# EAGLE design MaxRam (EAGLE 6.5.0)
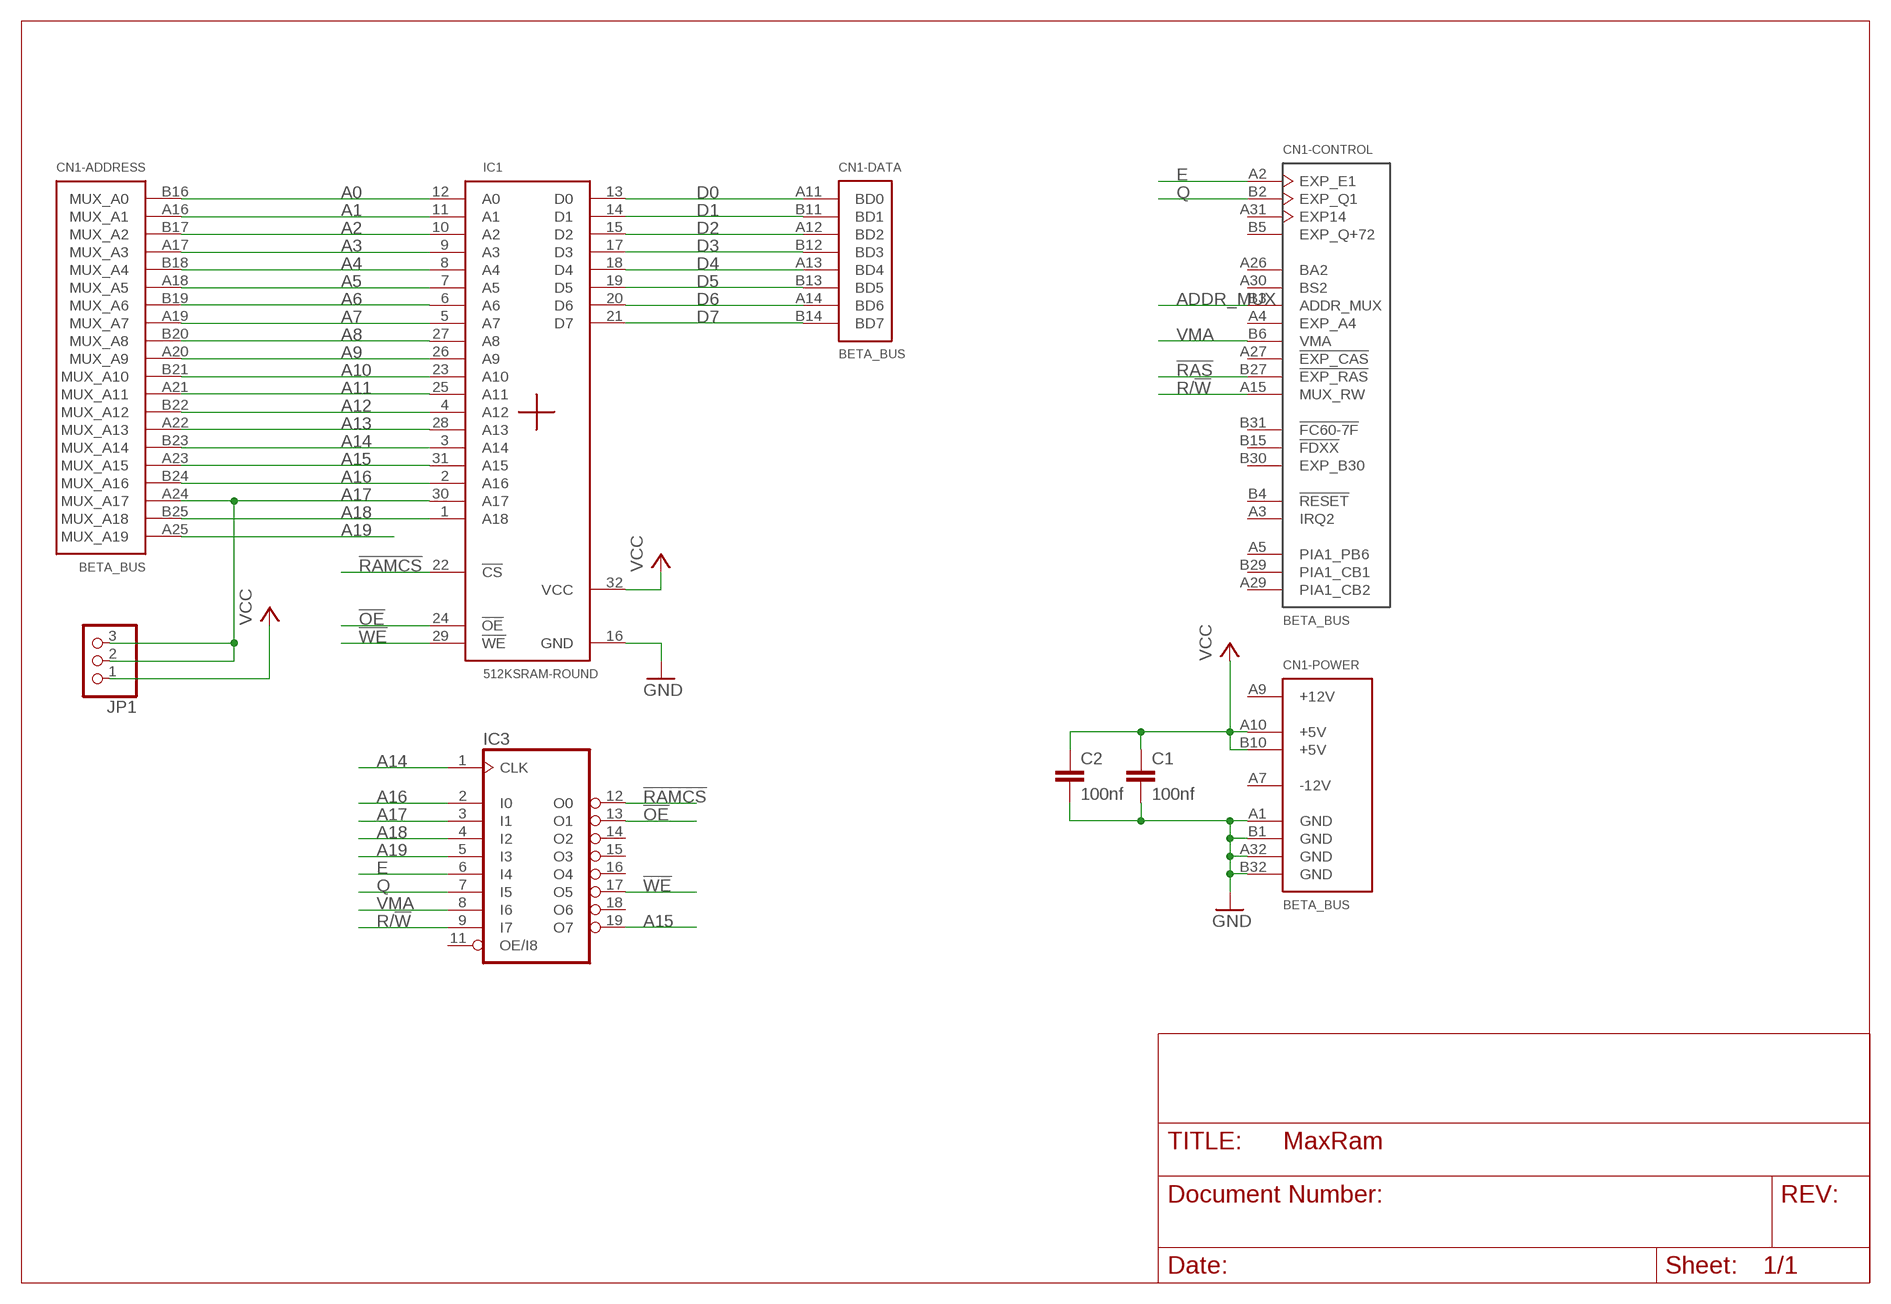
[diagram p0: schematic, sheet 1]

## Parts
C1  100nf  C-EU025-025X050  [C025-025X050]
C2  100nf  C-EU025-025X050  [C025-025X050]
CN1  BETA_BUS  [MAB64]
IC1  512KSRAM-ROUND  [DIL32-ROUND]
IC3  16V8-ROUND  [DIL20-R]
JP1  PINHD-1X3  [1X03]

## Nets
!OE: IC1.24(!OE) IC3.13(O1)
!RAMCS: IC1.22(!CS) IC3.12(O0)
!RAS: CN1.B27(-CONTROL:!EXP_RAS)
!WE: IC1.29(!WE) IC3.17(O5)
A0: CN1.B16(-ADDRESS:MUX_A0) IC1.12(A0)
A1: CN1.A16(-ADDRESS:MUX_A1) IC1.11(A1)
A2: CN1.B17(-ADDRESS:MUX_A2) IC1.10(A2)
A3: CN1.A17(-ADDRESS:MUX_A3) IC1.9(A3)
A4: CN1.B18(-ADDRESS:MUX_A4) IC1.8(A4)
A5: CN1.A18(-ADDRESS:MUX_A5) IC1.7(A5)
A6: CN1.B19(-ADDRESS:MUX_A6) IC1.6(A6)
A7: CN1.A19(-ADDRESS:MUX_A7) IC1.5(A7)
A8: CN1.B20(-ADDRESS:MUX_A8) IC1.27(A8)
A9: CN1.A20(-ADDRESS:MUX_A9) IC1.26(A9)
A10: CN1.B21(-ADDRESS:MUX_A10) IC1.23(A10)
A11: CN1.A21(-ADDRESS:MUX_A11) IC1.25(A11)
A12: CN1.B22(-ADDRESS:MUX_A12) IC1.4(A12)
A13: CN1.A22(-ADDRESS:MUX_A13) IC1.28(A13)
A14: CN1.B23(-ADDRESS:MUX_A14) IC1.3(A14) IC3.1(CLK)
A15: CN1.A23(-ADDRESS:MUX_A15) IC1.31(A15) IC3.19(O7)
A16: CN1.B24(-ADDRESS:MUX_A16) IC1.2(A16) IC3.2(I0)
A17: CN1.A24(-ADDRESS:MUX_A17) IC1.30(A17) IC3.3(I1) JP1.2 JP1.3
A18: CN1.B25(-ADDRESS:MUX_A18) IC1.1(A18) IC3.4(I2)
A19: CN1.A25(-ADDRESS:MUX_A19) IC3.5(I3)
ADDR_MUX: CN1.B3(-CONTROL:ADDR_MUX)
D0: CN1.A11(-DATA:BD0) IC1.13(D0)
D1: CN1.B11(-DATA:BD1) IC1.14(D1)
D2: CN1.A12(-DATA:BD2) IC1.15(D2)
D3: CN1.B12(-DATA:BD3) IC1.17(D3)
D4: CN1.A13(-DATA:BD4) IC1.18(D4)
D5: CN1.B13(-DATA:BD5) IC1.19(D5)
D6: CN1.A14(-DATA:BD6) IC1.20(D6)
D7: CN1.B14(-DATA:BD7) IC1.21(D7)
E: CN1.A2(-CONTROL:EXP_E1) IC3.6(I4)
GND: C1.2 C2.2 CN1.A1(-POWER:GND) CN1.A32(-POWER:GND) CN1.B1(-POWER:GND) CN1.B32(-POWER:GND) IC1.16(GND)
Q: CN1.B2(-CONTROL:EXP_Q1) IC3.7(I5)
R/!W: CN1.A15(-CONTROL:MUX_RW) IC3.9(I7)
VCC: C1.1 C2.1 CN1.A10(-POWER:+5V) CN1.B10(-POWER:+5V) IC1.32(VCC) JP1.1
VMA: CN1.B6(-CONTROL:VMA) IC3.8(I6)
Unconnected: CN1.A3(-CONTROL:IRQ2) CN1.A4(-CONTROL:EXP_A4) CN1.A5(-CONTROL:PIA1_PB6) CN1.A6(-SPARE:A6) CN1.A8(-SPARE:A8) CN1.A26(-CONTROL:BA2) CN1.A27(-CONTROL:!EXP_CAS) CN1.A28(-SPARE:A28) CN1.A29(-CONTROL:PIA1_CB2) CN1.A30(-CONTROL:BS2) CN1.A31(-CONTROL:EXP14) CN1.B4(-CONTROL:!RESET) CN1.B5(-CONTROL:EXP_Q+72) CN1.B7(-SPARE:B7) CN1.B8(-SPARE:B8) CN1.B9(-SPARE:B9) CN1.B15(-CONTROL:!FDXX) CN1.B26(-SPARE:B26) CN1.B28(-SPARE:B28) CN1.B29(-CONTROL:PIA1_CB1) CN1.B30(-CONTROL:EXP_B30) CN1.B31(-CONTROL:!FC60-7F) IC3.11(OE/I8) IC3.14(O2) IC3.15(O3) IC3.16(O4) IC3.18(O6)

## Power pins joined to a net without a drawn wire
+12V: CN1.A9(-POWER:+12V)
-12V: CN1.A7(-POWER:-12V)
GND: IC3.10(GND)
VCC: IC3.20(VCC)

## Library data of the parts
C1 C2 = rcl:C-EU: CAPACITOR, European symbol
CN1 = Conn-Dragon:BETA_BUS
IC1 = Rom-Ram:512KSRAM: 512K x 8 SRAM
IC3 = pal-phs:16V8: PAL
JP1 = pinhead-round:PINHD-1X3: PIN HEADER

## Board
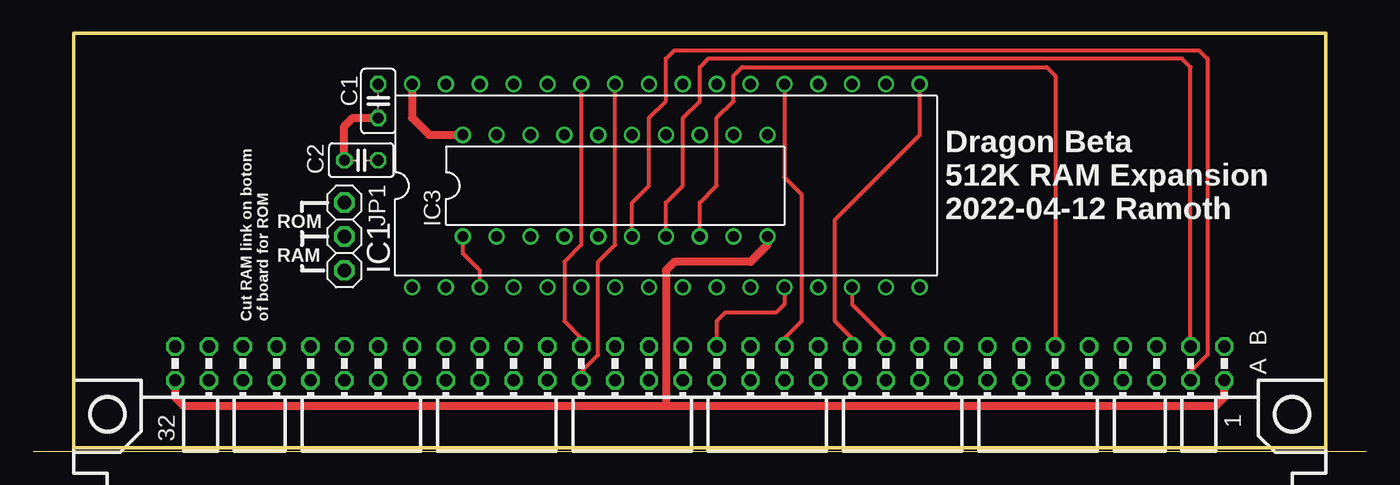
[diagram p1: board, top side]
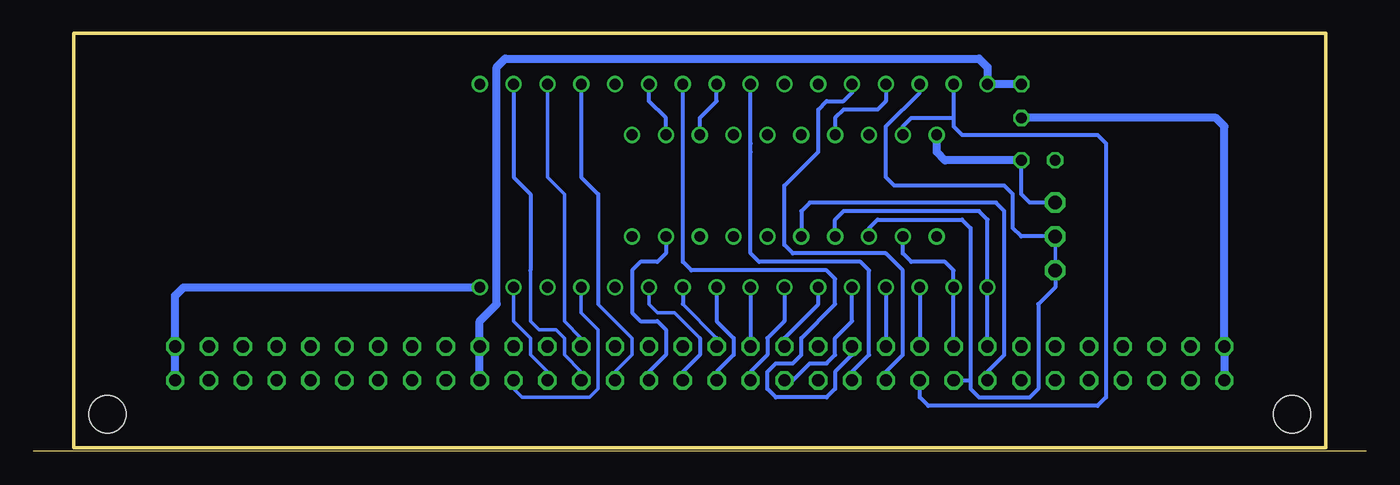
[diagram p2: board, bottom side, seen from below]

Size 93.97 x 31.09 mm. Coordinates in mm from the lower left corner, seen from the top.
Outline: 0,31.09 0,0 93.97,0 93.97,31.09 0,31.09
Copper layers (1*16): Top 0.035559375mm / dielectric 1.6mm / Bottom 0.035559375mm
Design rules "oshpark-2layer": minimum track width 6mil, minimum drill 10mil, track to track 6mil, track to pad 6mil, pad to pad 6mil, via to via 6mil, smd to smd 6mil, copper to edge 15mil, drill to drill 6mil, minimum pad ring 5mil, minimum via ring 5mil, stop-mask expansion 2.5mil, vias tented up to drill 0mil, thermal gap 10mil

### Footprints (pad centres in the part's own frame; a part is rotated, then mirrored left to right if it is on the bottom)
C025-025X050 = drill 0.813 octagon: 1 -1.27,0; 2 1.27,0
MAB64 = drill 0.914 octagon: A1 -2.54,39.37; A2 -2.54,36.83; A3 -2.54,34.29; A4 -2.54,31.75; A5 -2.54,29.21; A6 -2.54,26.67; A7 -2.54,24.13; A8 -2.54,21.59; A9 -2.54,19.05; A10 -2.54,16.51; A11 -2.54,13.97; A12 -2.54,11.43; A13 -2.54,8.89; A14 -2.54,6.35; A15 -2.54,3.81; A16 -2.54,1.27; A17 -2.54,-1.27; A18 -2.54,-3.81; A19 -2.54,-6.35; A20 -2.54,-8.89; A21 -2.54,-11.43; A22 -2.54,-13.97; A23 -2.54,-16.51; A24 -2.54,-19.05; A25 -2.54,-21.59; A26 -2.54,-24.13; A27 -2.54,-26.67; A28 -2.54,-29.21; A29 -2.54,-31.75; A30 -2.54,-34.29; A31 -2.54,-36.83; A32 -2.54,-39.37; B1 -5.08,39.37; B2 -5.08,36.83; B3 -5.08,34.29; B4 -5.08,31.75; B5 -5.08,29.21; B6 -5.08,26.67; B7 -5.08,24.13; B8 -5.08,21.59; B9 -5.08,19.05; B10 -5.08,16.51; B11 -5.08,13.97; B12 -5.08,11.43; B13 -5.08,8.89; B14 -5.08,6.35; B15 -5.08,3.81; B16 -5.08,1.27; B17 -5.08,-1.27; B18 -5.08,-3.81; B19 -5.08,-6.35; B20 -5.08,-8.89; B21 -5.08,-11.43; B22 -5.08,-13.97; B23 -5.08,-16.51; B24 -5.08,-19.05; B25 -5.08,-21.59; B26 -5.08,-24.13; B27 -5.08,-26.67; B28 -5.08,-29.21; B29 -5.08,-31.75; B30 -5.08,-34.29; B31 -5.08,-36.83; B32 -5.08,-39.37 | hole 2.794: 0,44.45; 0,-44.45
DIL32-ROUND = drill 0.813: 1 -19.05,-7.62; 2 -16.51,-7.62; 3 -13.97,-7.62; 4 -11.43,-7.62; 5 -8.89,-7.62; 6 -6.35,-7.62; 7 -3.81,-7.62; 8 -1.27,-7.62; 9 1.27,-7.62; 10 3.81,-7.62; 11 6.35,-7.62; 12 8.89,-7.62; 13 11.43,-7.62; 14 13.97,-7.62; 15 16.51,-7.62; 16 19.05,-7.62; 17 19.05,7.62; 18 16.51,7.62; 19 13.97,7.62; 20 11.43,7.62; 21 8.89,7.62; 22 6.35,7.62; 23 3.81,7.62; 24 1.27,7.62; 25 -1.27,7.62; 26 -3.81,7.62; 27 -6.35,7.62; 28 -8.89,7.62; 29 -11.43,7.62; 30 -13.97,7.62; 31 -16.51,7.62; 32 -19.05,7.62
DIL20-R = drill 0.813: 1 -11.43,-3.81; 2 -8.89,-3.81; 3 -6.35,-3.81; 4 -3.81,-3.81; 5 -1.27,-3.81; 6 1.27,-3.81; 7 3.81,-3.81; 8 6.35,-3.81; 9 8.89,-3.81; 10 11.43,-3.81; 11 11.43,3.81; 12 8.89,3.81; 13 6.35,3.81; 14 3.81,3.81; 15 1.27,3.81; 16 -1.27,3.81; 17 -3.81,3.81; 18 -6.35,3.81; 19 -8.89,3.81; 20 -11.43,3.81
1X03 = drill 1.016 octagon: 1 -2.54,0; 2 0,0; 3 2.54,0

### Placement (x,y rotation side)
C1  22.86,26.02 270 top
C2  21.59,21.57 180 top
CN1  46.99,2.52 270 top
IC1  44.45,19.66 0 top
IC3  40.64,19.66 0 top
JP1  20.32,15.86 270 top

### Tracks (layer width: path | path; a pad name or v marks a point on that pad's centre or on a via)
!OE
  Bottom 0.305: IC3.13 46.99,24.75 45.72,26.02 IC1.24
!RAMCS
  Bottom 0.305: IC3.12 49.53,24.75 50.8,26.02 IC1.22
!WE
  Bottom 0.305: IC1.29 33.02,26.02 33.66,25.38 36.2,25.38 36.83,24.75 IC3.17
A0
  Top 0.305: IC1.12 53.34,10.78 52.7,10.14 48.9,10.14 48.26,9.51 CN1.B16
A1
  Bottom 0.254: 46.99,8.24 48.9,10.14 50.16,10.14 50.8,10.78 IC1.11
  Bottom 0.305: 46.99,8.24 46.99,6.97 48.26,5.7 CN1.A16
A2
  Bottom 0.254: 45.72,8.24 48.26,10.78
  Bottom 0.305: IC1.10 48.26,10.78 | 45.72,8.24 CN1.B17
A3
  Bottom 0.305: IC1.9 45.72,9.51 44.45,8.24 44.45,6.97 45.72,5.7 CN1.A17
A4
  Bottom 0.305: IC1.8 CN1.B18
A5
  Bottom 0.305: IC1.7 40.64,9.51 41.91,8.24 41.91,6.97 43.18,5.7 CN1.A18
A6
  Bottom 0.305: CN1.B19 40.64,8.24 38.1,10.78 IC1.6
A7
  Bottom 0.305: CN1.A19 40.01,5.06 38.73,6.33 37.47,6.33 36.83,6.97 36.83,8.24 35.56,9.51 IC1.5
A8
  Top 0.305: IC1.27 38.1,15.22 36.83,13.95 36.83,9.51 38.1,8.24 CN1.B20
A9
  Top 0.305: CN1.A20 38.1,5.7 39.37,6.97 39.37,13.95 40.64,15.22 IC1.26
A10
  Bottom 0.305: CN1.B21 35.56,6.97 36.83,5.7 36.83,4.43 37.47,3.79 41.27,3.79 41.91,4.43 41.91,5.7 41.27,6.33 40.01,6.33 39.37,6.97 39.37,8.24 36.83,10.78 36.83,12.68 37.47,13.32 47.62,13.32 48.26,13.95 IC1.23
A11
  Bottom 0.305: CN1.A21 35.56,5.7 34.29,6.97 34.29,13.32 34.93,13.95 42.55,13.95 43.18,14.59 43.18,22.21 43.18,22.84 IC1.25
A12
  Bottom 0.305: IC1.4 CN1.B22
A13
  Bottom 0.305: CN1.A22 33.02,5.7 31.75,6.97 31.75,13.32 33.02,14.59 40.01,14.59 40.64,15.22 40.64,19.66 38.1,22.21 38.1,25.38 37.47,26.02 36.2,26.02 35.56,26.65 IC1.28
A14
  Top 0.305: IC3.1 29.21,14.59 30.48,13.32 IC1.3
  Bottom 0.305: IC1.3 CN1.B23
A15
  Bottom 0.305: IC1.31 27.94,24.75 | 27.94,24.75 27.94,24.11 27.3,23.48 17.14,23.48 16.51,22.84 16.51,3.79 17.14,3.15 29.84,3.15 30.48,3.79 CN1.A23 | IC3.19 31.75,24.11 31.12,24.75 27.94,24.75
A16
  Bottom 0.305: CN1.B24 IC1.2 27.94,13.32 28.57,13.95 31.12,13.95 31.75,14.59 IC3.2
A17
  Bottom 0.254: JP1.3 JP1.2
  Bottom 0.305: IC3.3 34.29,16.49 33.66,17.12 27.3,17.12 26.67,16.49 26.67,5.06 | 26.67,5.06 26.67,4.43 26.04,3.79 22.23,3.79 21.59,4.43 21.59,10.78 20.32,12.04 JP1.3 | CN1.A24 26.67,5.06 | JP1.2 22.86,15.86 23.5,16.49 23.5,19.03 24.13,19.66 32.38,19.66 33.02,20.3 33.02,24.11 30.48,26.65 IC1.30
A18
  Bottom 0.305: CN1.B25 IC1.1 25.4,17.12 26.04,17.76 36.2,17.76 36.83,17.12 IC3.4
A19
  Bottom 0.305: CN1.A25 25.4,5.7 24.13,6.97 24.13,17.76 24.77,18.39 38.73,18.39 39.37,17.76 IC3.5
D0
  Bottom 0.254: IC1.13 55.88,10.14 54.61,8.87 54.61,4.43 55.24,3.79 60.33,3.79 60.96,4.43 CN1.A11
D1
  Top 0.305: IC1.14 58.42,10.78 60.96,8.24 CN1.B11
D2
  Bottom 0.254: CN1.A12 58.42,5.7 59.69,6.97 59.69,8.24 60.96,9.51 IC1.15
D3
  Top 0.305: CN1.B12 58.42,8.24 57.15,9.51 57.15,17.12 63.5,23.48 IC1.17
D4
  Bottom 0.254: 59.69,13.32 59.69,9.51 59.05,8.87 57.79,8.87 57.15,8.24 57.15,6.97 55.88,5.7 CN1.A13
  Bottom 0.305: IC1.18 60.96,20.3 59.69,19.03 59.69,13.32
D5
  Bottom 0.254: CN1.B13 55.88,8.24 57.15,9.51 57.15,19.03 58.42,20.3 IC1.19
D6
  Bottom 0.254: 53.34,5.7 52.07,6.97 52.07,8.24 54.61,10.78
  Bottom 0.305: IC1.20 55.88,20.3 54.61,19.03 54.61,10.78 | 53.34,5.7 CN1.A14
D7
  Top 0.305: IC1.21 53.34,20.3 54.61,19.03 54.61,9.51 53.34,8.24 CN1.B14
E
  Top 0.305: CN1.A2 83.82,5.7 85.09,6.97 85.09,29.19 84.45,29.82 45.09,29.82 44.45,29.19 44.45,26.02 43.18,24.75 43.18,19.66 41.91,18.39 IC3.6
GND
  Top 0.61: CN1.A32 7.62,3.79 8.25,3.15 44.45,3.15 | 44.45,3.15 85.72,3.15 86.36,3.79 CN1.A1 | IC3.10 52.07,15.22 50.8,13.95 45.09,13.95 44.45,13.32 44.45,3.15 | C2.2 20.32,24.11 20.96,24.75 C1.2
  Bottom 0.61: CN1.A1 CN1.B1 86.36,11.41 85.72,12.04 IC1.16 | C1.2 8.25,24.75 7.62,24.11 CN1.B32 CN1.A32
Q
  Top 0.305: CN1.B2 83.82,28.55 83.18,29.19 47.62,29.19 46.99,28.55 46.99,26.02 45.72,24.75 45.72,19.66 44.45,18.39 IC3.7
R/!W
  Bottom 0.305: IC3.9 49.53,14.59 50.16,13.95 51.44,13.95 52.07,13.32 52.07,10.14 51.44,9.51 50.16,9.51 49.53,8.87 49.53,6.97 50.8,5.7 CN1.A15
VCC
  Top 0.61: IC1.32 25.4,24.75 26.67,23.48 IC3.20
  Bottom 0.305: JP1.1 22.23,18.39 22.86,19.03 C2.1
  Bottom 0.61: C1.1 IC1.32 25.4,28.55 26.04,29.19 61.6,29.19 62.23,28.55 62.23,10.78 63.5,9.51 CN1.B10 CN1.A10 | C2.1 28.57,21.57 29.21,22.21 IC3.20
VMA
  Top 0.305: CN1.B6 73.66,27.92 73.02,28.55 50.16,28.55 49.53,27.92 49.53,26.02 48.26,24.75 48.26,19.66 46.99,18.39 IC3.8

### Text on the board
tPlace: ROM | Dragon Beta / 512K RAM Expansion / 2022-04-12 Ramoth | RAM | Cut RAM link on botom / of board for ROM